# EAGLE schematic untitled (EAGLE 8.0.1)
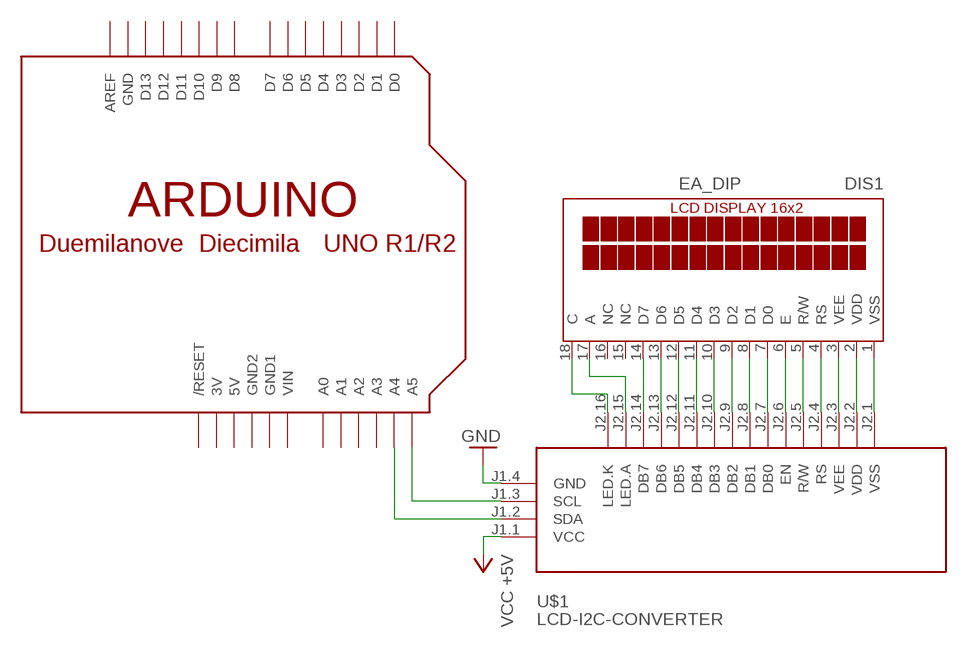
[diagram p0: schematic, sheet 1]

## Parts
DIS1  EA_DIP  [EA_DIP]
U$1  LCD-I2C-CONVERTER  [LCD-I2C-CONVERTER]
U$2  ARDUINOUNO  [ARDUINO]

## Nets
GND: U$1.J1.4(GND)
N$1: DIS1.18(C) U$1.J2.16(LED.K)
N$2: DIS1.17(A) U$1.J2.15(LED.A)
N$3: DIS1.14(D7) U$1.J2.14(DB7)
N$4: DIS1.13(D6) U$1.J2.13(DB6)
N$5: DIS1.12(D5) U$1.J2.12(DB5)
N$6: DIS1.11(D4) U$1.J2.11(DB4)
N$7: DIS1.10(D3) U$1.J2.10(DB3)
N$8: DIS1.9(D2) U$1.J2.9(DB2)
N$9: DIS1.8(D1) U$1.J2.8(DB1)
N$10: DIS1.7(D0) U$1.J2.7(DB0)
N$11: DIS1.6(E) U$1.J2.6(EN)
N$12: DIS1.5(R/W) U$1.J2.5(R/W)
N$13: DIS1.4(RS) U$1.J2.4(RS)
N$14: DIS1.3(VEE) U$1.J2.3(VEE)
N$15: DIS1.2(VDD) U$1.J2.2(VDD)
N$16: DIS1.1(VSS) U$1.J2.1(VSS)
N$17: U$1.J1.2(SDA) U$2.A4
N$18: U$1.J1.3(SCL) U$2.A5
VCC: U$1.J1.1(VCC) ; supply symbol labelled VCC +5V
Unconnected: DIS1.15(NC) DIS1.16(NC) U$2.A0 U$2.A1 U$2.A2 U$2.A3 U$2.AREF U$2.D0 U$2.D1 U$2.D2 U$2.D3 U$2.D4 U$2.D5 U$2.D6 U$2.D7 U$2.D8 U$2.D9 U$2.D10 U$2.D11 U$2.D12 U$2.D13 U$2.RESET(/RESET)

## Power pins joined to a net without a drawn wire
3V: U$2.3V
5V: U$2.5V
GND: U$2.GND
GND1: U$2.GND1
GND2: U$2.GND2
VIN: U$2.VIN

## Library data of the parts
DIS1 = display-lcd:EA_DIP: LCD-MODUL 2x16 - 6,68mm, INKL. KONTROLLER HD44780 Source: Data sheet <http://www.lcd-module.de/pdf/doma/dip162-d.pdf>
U$1 = diy-modules:LCD-I2C-CONVERTER: I2C Bus to 4-Bit Parallel LCD Interface with LED backlight driver
U$2 = adafruit:ARDUINO: Arduino Diecimila/Duemilanove Make a shield with ease, this package has all the named pins as well as the two mounting drill holes and an outline of the USB and DC power connector. The outline is on the DIMENSION layer, so if your board house uses it they will cut the outline to match. http://www.ladyada.net/library/pcb/eaglelibrary.html